# Altium schematic sheet ind3200.SchDoc
size A4
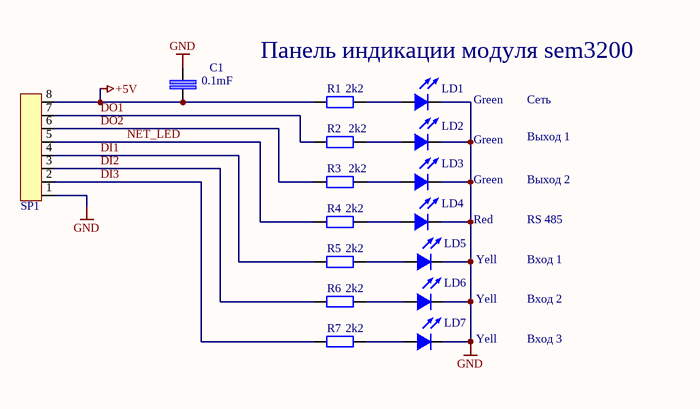
[diagram p0: ind3200.SchDoc]

## Parts
C1  value 0.1mF  [CAPC2113X13N_0805]  (hidden comment: 0.1)
LD1  Green  [LED_3]
LD2  Green  [LED_3]
LD3  Green  [LED_3]
LD4  Red  [LED_3]
LD5  Yell  [LED_3]
LD6  Yell  [LED_3]
LD7  Yell  [LED_3]
R1  value 2k2  [RESC2113X0805N]  (hidden comment: 1k)
R2  value 2k2  [RESC2113X0805N]  (hidden comment: 1k)
R3  value 2k2  [RESC2113X0805N]  (hidden comment: 1k)
R4  value 2k2  [RESC2113X0805N]  (hidden comment: 1k)
R5  value 2k2  [RESC2113X0805N]  (hidden comment: 1k)
R6  value 2k2  [RESC2113X0805N]  (hidden comment: 1k)
R7  value 2k2  [RESC2113X0805N]  (hidden comment: 1k)
SP1  SP1  [Conn8x1]  (value not drawn)

## Nets
+5V: C1.2 R1.2 SP1.8
GND: C1.1 LD1.2 LD2.2 LD3.2 LD4.2 LD5.2 LD6.2 LD7.2 SP1.1
DI1: R5.2 SP1.4
DI2: R6.2 SP1.3
DI3: R7.2 SP1.2
DO1: R2.2 SP1.7
DO2: R3.2 SP1.6
NET_LED: R4.2 SP1.5
NetLD1_1: LD1.1 R1.1
NetLD2_1: LD2.1 R2.1
NetLD3_1: LD3.1 R3.1
NetLD4_1: LD4.1 R4.1
NetLD5_1: LD5.1 R5.1
NetLD6_1: LD6.1 R6.1
NetLD7_1: LD7.1 R7.1

## Notes on the sheet
- Панель индикации модуля sem3200
- Сеть
- Выход 1
- Выход 2
- RS 485
- Вход 1
- Вход 2
- Вход 3

## Library data of the parts
C1 = cap_1
LD1-LD3 = LED_1: Type: L-1154GD
LD4 = LED_1: Type: BL-B4541Q R
LD5-LD7 = LED_1: Type: L-1154YD
R1-R7 = rez_1
SP1 = Conn8x1: Type: PLS-8 (DS1021-1x8)